# Altium schematic sheet Antenna.SchDoc
size A; SheetNumber: 2; SheetTotal: 4
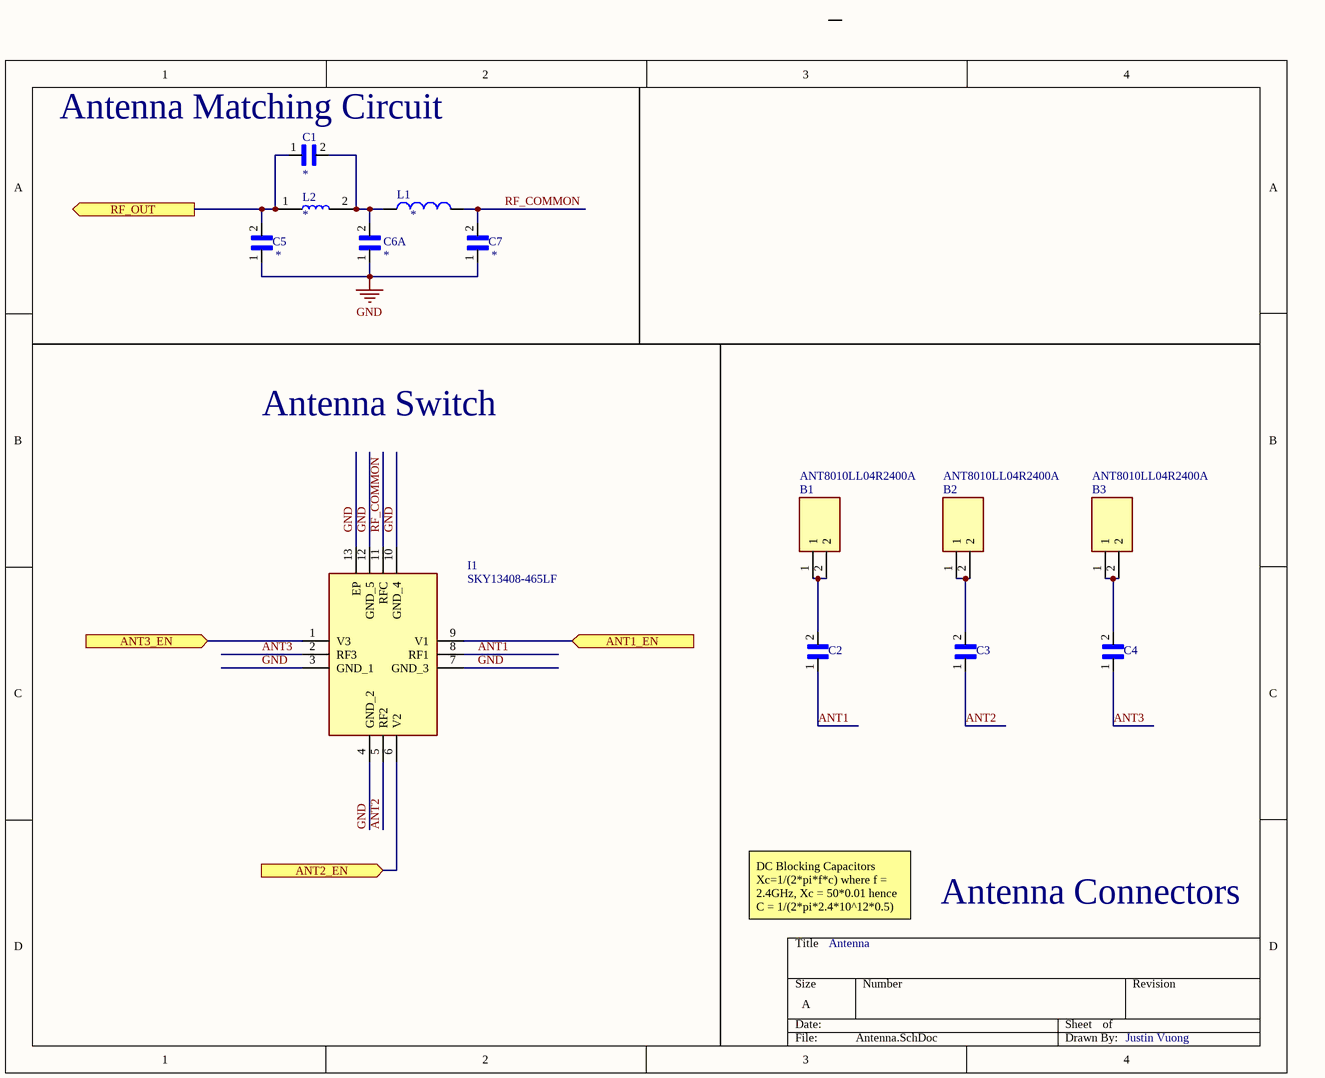
[diagram p0: Antenna.SchDoc]

## Parts
B1  ANT8010LL04R2400A  [ANT8010LL04R2400A]
B2  ANT8010LL04R2400A  [ANT8010LL04R2400A]
B3  ANT8010LL04R2400A  [ANT8010LL04R2400A]
C1  GRM0335C1HR40BA01D  [INDC0603X33N]  (value not drawn)
C2  GCM1555C1HR80BA16D  [CAPC1005X55N]  (value not drawn)
C3  GCM1555C1HR80BA16D  [CAPC1005X55N]  (value not drawn)
C4  GCM1555C1HR80BA16D  [CAPC1005X55N]  (value not drawn)
C5  GCM1555C1HR80BA16D  [CAPC1005X55N]  (value not drawn)
C6  GRM0335C1H1R6BA01D  [CAPC0603X33N]  (value not drawn)  (part A of 2)
C7  GRM0335C1HR60BA01D  [CAPC0603X33N]  (value not drawn)
I1  SKY13408-465LF  [QFN50P200X200X65-13N-D]
L1  LQP03TN3N0B02D  [INDC0603X33N]  (value not drawn)
L2  L-07C2N4SV6T  [INDC1005X60N]  (value not drawn)

## Ports
ANT1_EN (in, see Proc[1C]), ANT2_EN (in, see Proc[1C]), ANT3_EN (in, see Proc[1C]), RF_OUT (out, see Proc[1C])

## Nets
GND: C5.1 C6.1 C7.1 I1.3(GND_1) I1.4(GND_2) I1.7(GND_3) I1.10(GND_4) I1.12(GND_5) I1.13(EP)
ANT1: C2.1 I1.8(RF1)
ANT1_EN: I1.9(V1) ; port ANT1_EN
ANT2: C3.1 I1.5(RF2)
ANT2_EN: I1.6(V2) ; port ANT2_EN
ANT3: C4.1 I1.2(RF3)
ANT3_EN: I1.1(V3) ; port ANT3_EN
RF_COMMON: C7.2 I1.11(RFC) L1.2
RF_OUT: C1.1 C5.2 L2.1 ; port RF_OUT
NetB1_1: B1.1 B1.2 C2.2
NetB2_1: B2.1 B2.2 C3.2
NetB3_1: B3.1 B3.2 C4.2
NetC1_2: C1.2 C6.2 L1.1 L2.2

## Notes on the sheet
- (near C1) Antenna Matching Circuit
- Antenna Switch
- DC Blocking Capacitors                   Xc=1/(2*pi*f*c) where f = 2.4GHz, Xc = 50*0.01 hence                                  C = 1/(2*pi*2.4*10^12*0.5)    C = 132pF
- Antenna
- Antenna Connectors
- Justin Vuong

## Library data of the parts
B1-B3 = ANT8010LL04R2400A: Antennas 2.4GHz 50 Ohm 1W CHIP ANTENNA; Manufacturer_Name: Pulse Electronics; Geometry.Height: 1.1mm; Mouser Part Number: 603-ANT8010LL04R2400; Mouser Price/Stock: https://www.mouser.co.uk/ProductDetail/PulseLarsen-Antennas/ANT8010LL04R2400A?qs=CqAAFKzD4h85SLrouu%252B8rQ%3D%3D; Manufacturer_Part_Number: ANT8010LL04R2400A; Datasheet Link: *
C1 = GRM0335C1HR40BA01D: 0201 50 V 0.4 pF Â±0.1 pF Tolerance C0G Monolithic Ceramic Chip Capacitor; Package: None; Price: None; Value: *; MP: GRM0335C1HR40BA01D; Availability: Unavailable
C2-C5 = GCM1555C1HR80BA16D: SMD Capacitor C0G(EIA) with Capacitance: 0.80pF Tol. 0.1pF. Rated Voltage: 50Vdc; Package: None; Price: None; Value: *; MP: GCM1555C1HR80BA16D; Availability: Unavailable
C6 = GRM0335C1H1R6BA01D: SMD capacitor C0G(EIA) with capacitance 1.6pF Tol.0.1pF. Rated voltage 50Vdc 125C; MF: Murata; Price: None; SnapEDA_Link: https://www.snapeda.com/parts/GRM0335C1H1R6BA01D/Murata/view-part/1800095/?ref=snap; Purchase-URL: https://pricing.snapeda.com/search/part/GRM0335C1H1R6BA01D/?ref=eda; Check_prices: https://www.snapeda.com/parts/GRM0335C1H1R6BA01D/Murata/view-part/1800095/?ref=eda; Value: *; MP: GRM0335C1H1R6BA01D; Package: 0603 Taiyo Yuden; Availability: Warning
C7 = GRM0335C1HR60BA01D: Cap Ceramic 0.6pF 50V C0G 0.1pF Pad SMD 0201 125C T/R; Package: None; Price: None; Value: *; MP: GRM0335C1HR60BA01D; Availability: Unavailable
I1 = SKY13408-465LF: RF Switch ICs 1-6GHz SP3T Typ. IIP3 54dBm; Manufacturer_Name: Skyworks; Geometry.Height: 0.65mm; Mouser Part Number: 873-SKY13408-465LF; Mouser Price/Stock: https://www.mouser.co.uk/ProductDetail/Skyworks-Solutions-Inc/SKY13408-465LF?qs=vH2uEH3KBjVVWQxF8QP0rg%3D%3D; Manufacturer_Part_Number: SKY13408-465LF; Datasheet Link: https://datasheet.datasheetarchive.com/originals/distributors/DKDS-19/379019.pdf
L1 = LQP03TN3N0B02D: Inductor with Inductance: 3nH Tol. +/-0.1nH, Package: 0201 (0603); MF: Murata; Check_prices: https://www.snapeda.com/parts/LQP03TN3N0B02D/Murata%20Electronics%20North%20America/view-part/1501789/?ref=eda; Package: 0603 Murata; Digi-Key_Part_Number: 490-6727-1-ND; Value: *; MP: LQP03TN3N0B02D; SnapEDA_Link: https://www.snapeda.com/parts/LQP03TN3N0B02D/Murata%20Electronics%20North%20America/view-part/1501789/?ref=snap; Purchase-URL: https://pricing.snapeda.com/search/part/LQP03TN3N0B02D/?ref=eda
L2 = L-07C2N4SV6T: INDUCTOR RF, 0402, 2.4NH, Â±0.3NH; Inductance:2.4nH; Inductance Tolerance:Â± 0.3nH; Self Resonant Frequency:10GHz; DC Current Rating:300mA; Q Factor:8; Q Test Frequency:100MHz; Inductor Case Style:0402; No. of Pins:2; Core Material:Ceramic; Q @ Vr F:8; Package: None; Price: None; Value: *; MP: L-07C2N4SV6T; Availability: Unavailable